# EAGLE design zmJackBoard (EAGLE 8.6.3)
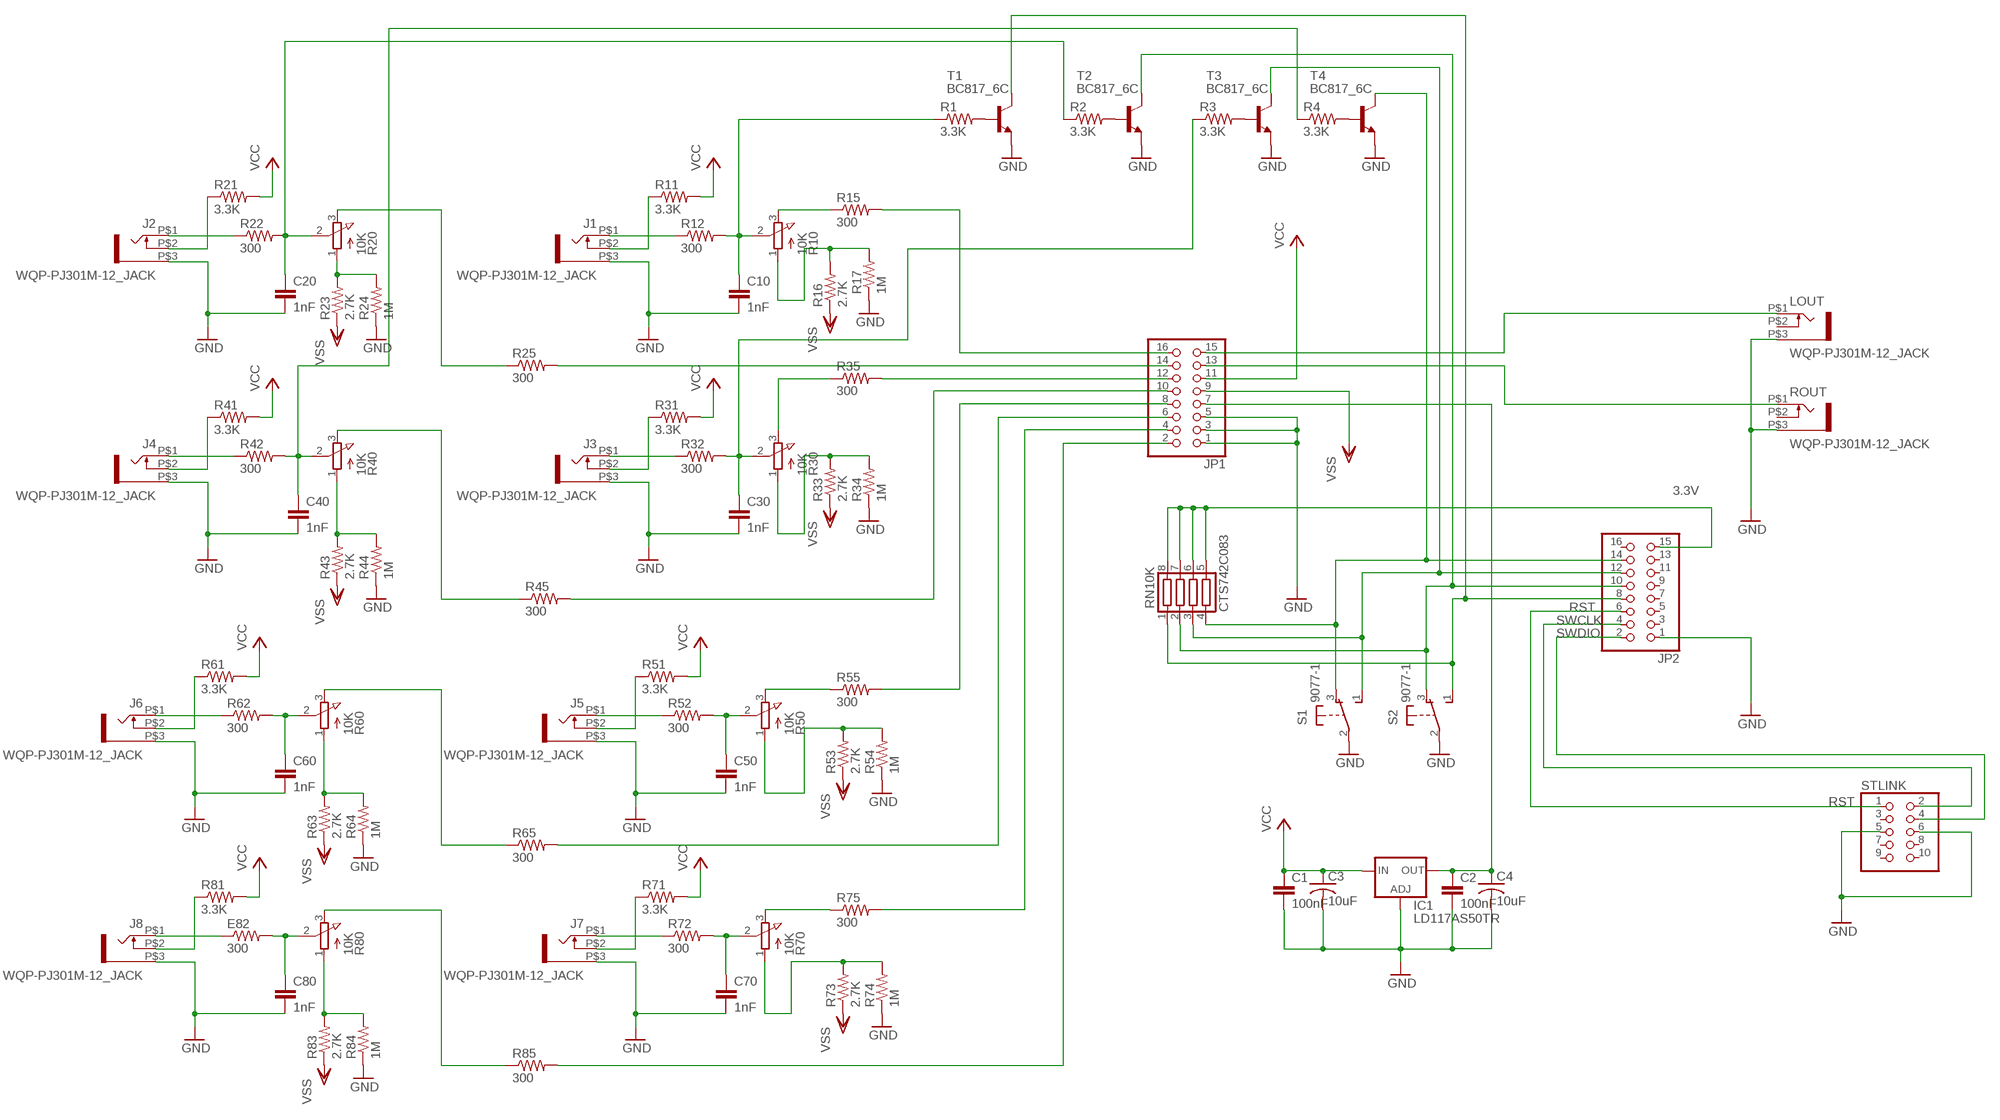
[diagram p0: schematic, sheet 1]

## Parts
C1  100nF  C-EUC0805  [C0805]
C2  100nF  C-EUC0805  [C0805]
C3  10uF  C-USC1206  [C1206]
C4  10uF  C-USC1206  [C1206]
C10  1nF  C-EUC0805  [C0805]
C20  1nF  C-EUC0805  [C0805]
C30  1nF  C-EUC0805  [C0805]
C40  1nF  C-EUC0805  [C0805]
C50  1nF  C-EUC0805  [C0805]
C60  1nF  C-EUC0805  [C0805]
C70  1nF  C-EUC0805  [C0805]
C80  1nF  C-EUC0805  [C0805]
E82  300  R-US_M0805  [M0805]
IC1  LD117AS50TR  [SOT223]
J1  WQP-PJ301M-12_JACK  [WQP-PJ301M-12_JACK]
J2  WQP-PJ301M-12_JACK  [WQP-PJ301M-12_JACK]
J3  WQP-PJ301M-12_JACK  [WQP-PJ301M-12_JACK]
J4  WQP-PJ301M-12_JACK  [WQP-PJ301M-12_JACK]
J5  WQP-PJ301M-12_JACK  [WQP-PJ301M-12_JACK]
J6  WQP-PJ301M-12_JACK  [WQP-PJ301M-12_JACK]
J7  WQP-PJ301M-12_JACK  [WQP-PJ301M-12_JACK]
J8  WQP-PJ301M-12_JACK  [WQP-PJ301M-12_JACK]
JP1  PINHD-2X8  [2X08]
JP2  PINHD-2X8  [2X08]
LOUT  WQP-PJ301M-12_JACK  [WQP-PJ301M-12_JACK]
R1  3.3K  R-US_M0805  [M0805]
R2  3.3K  R-US_M0805  [M0805]
R3  3.3K  R-US_M0805  [M0805]
R4  3.3K  R-US_M0805  [M0805]
R10  10K  EVUF3L  [EVUFXL]
R11  3.3K  R-US_M0805  [M0805]
R12  300  R-US_M0805  [M0805]
R15  300  R-US_M0805  [M0805]
R16  2.7K  R-US_M0805  [M0805]
R17  1M  R-US_M0805  [M0805]
R20  10K  EVUF3L  [EVUFXL]
R21  3.3K  R-US_M0805  [M0805]
R22  300  R-US_M0805  [M0805]
R23  2.7K  R-US_M0805  [M0805]
R24  1M  R-US_M0805  [M0805]
R25  300  R-US_M0805  [M0805]
R30  10K  EVUF3L  [EVUFXL]
R31  3.3K  R-US_M0805  [M0805]
R32  300  R-US_M0805  [M0805]
R33  2.7K  R-US_M0805  [M0805]
R34  1M  R-US_M0805  [M0805]
R35  300  R-US_M0805  [M0805]
R40  10K  EVUF3L  [EVUFXL]
R41  3.3K  R-US_M0805  [M0805]
R42  300  R-US_M0805  [M0805]
R43  2.7K  R-US_M0805  [M0805]
R44  1M  R-US_M0805  [M0805]
R45  300  R-US_M0805  [M0805]
R50  10K  EVUF3L  [EVUFXL]
R51  3.3K  R-US_M0805  [M0805]
R52  300  R-US_M0805  [M0805]
R53  2.7K  R-US_M0805  [M0805]
R54  1M  R-US_M0805  [M0805]
R55  300  R-US_M0805  [M0805]
R60  10K  EVUF3L  [EVUFXL]
R61  3.3K  R-US_M0805  [M0805]
R62  300  R-US_M0805  [M0805]
R63  2.7K  R-US_M0805  [M0805]
R64  1M  R-US_M0805  [M0805]
R65  300  R-US_M0805  [M0805]
R70  10K  EVUF3L  [EVUFXL]
R71  3.3K  R-US_M0805  [M0805]
R72  300  R-US_M0805  [M0805]
R73  2.7K  R-US_M0805  [M0805]
R74  1M  R-US_M0805  [M0805]
R75  300  R-US_M0805  [M0805]
R80  10K  EVUF3L  [EVUFXL]
R81  3.3K  R-US_M0805  [M0805]
R83  2.7K  R-US_M0805  [M0805]
R84  1M  R-US_M0805  [M0805]
R85  300  R-US_M0805  [M0805]
RN10K  CTS742C083  [CTS742C083]
ROUT  WQP-PJ301M-12_JACK  [WQP-PJ301M-12_JACK]
S1  9077-1  [9077-1]
S2  9077-1  [9077-1]
STLINK  PINHD-2X5  [2X05]
T1  BC817_6C  -NPN-SOT23-EBC  [SOT23-EBC]
T2  BC817_6C  -NPN-SOT23-EBC  [SOT23-EBC]
T3  BC817_6C  -NPN-SOT23-EBC  [SOT23-EBC]
T4  BC817_6C  -NPN-SOT23-EBC  [SOT23-EBC]

## Nets
3.3V: JP2.15 RN10K.5 RN10K.6 RN10K.7 RN10K.8
5V: C2.1 C4.1 IC1.4(OUT) JP1.7
ADC1: JP1.16 R15.2
ADC2: JP1.14 R25.2
ADC3: JP1.12 R35.2
ADC4: JP1.10 R45.2
ADC5: JP1.8 R55.2
ADC6: JP1.6 R65.2
ADC7: JP1.4 R75.2
ADC8: JP1.2 R85.2
GND: C1.2 C2.2 C3.2 C4.2 C10.2 C20.2 C30.2 C40.2 C50.2 C60.2 C70.2 C80.2 IC1.1(ADJ) J1.P$3 J2.P$3 J3.P$3 J4.P$3 J5.P$3 J6.P$3 J7.P$3 J8.P$3 JP1.1 JP1.3 JP1.5 JP2.1 LOUT.P$3 R17.1 R24.1 R34.1 R44.1 R54.1 R64.1 R74.1 R84.1 ROUT.P$3 S1.2(P) S2.2(P) STLINK.5 STLINK.6 T1.E T2.E T3.E T4.E
LOUT: JP1.15 LOUT.P$1
N$1: J2.P$1 R22.1
N$2: R30.3(E) R35.1
N$3: J2.P$2 R21.1
N$4: C20.1 R2.1 R20.2(S) R22.2
N$5: J1.P$2 R11.1
N$6: J4.P$2 R41.1
N$7: J4.P$1 R42.1
N$8: C40.1 R4.1 R40.2(S) R42.2
N$12: J1.P$1 R12.1
N$13: J6.P$2 R61.1
N$14: J6.P$1 R62.1
N$15: C60.1 R60.2(S) R62.2
N$16: C10.1 R1.1 R10.2(S) R12.2
N$17: J8.P$2 R81.1
N$18: E82.1 J8.P$1
N$19: C80.1 E82.2 R80.2(S)
N$20: J3.P$2 R31.1
N$21: J3.P$1 R32.1
N$22: C30.1 R3.1 R30.2(S) R32.2
N$23: J5.P$2 R51.1
N$24: J5.P$1 R52.1
N$25: C50.1 R50.2(S) R52.2
N$26: J7.P$2 R71.1
N$27: J7.P$1 R72.1
N$28: C70.1 R70.2(S) R72.2
N$35: JP2.8 RN10K.1 S2.1(S) T1.C
N$36: JP2.10 RN10K.2 S2.3(O) T2.C
N$37: JP2.12 RN10K.3 S1.1(S) T3.C
N$39: JP2.14 RN10K.4 S1.3(O) T4.C
N$40: R1.2 T1.B
N$41: R2.2 T2.B
N$42: R3.2 T3.B
N$43: R4.2 T4.B
N$44: R40.3(E) R45.1
N$46: R20.3(E) R25.1
N$47: R60.3(E) R65.1
N$48: R80.3(E) R85.1
N$49: R10.3(E) R15.1
N$50: R50.3(E) R55.1
N$51: R70.3(E) R75.1
N$53: R10.1(A) R16.2 R17.2
N$57: R80.1(A) R83.2 R84.2
N$58: R60.1(A) R63.2 R64.2
N$59: R40.1(A) R43.2 R44.2
N$60: R20.1(A) R23.2 R24.2
N$61: R30.1(A) R33.2 R34.2
N$62: R50.1(A) R53.2 R54.2
N$63: R70.1(A) R73.2 R74.2
ROUT: JP1.13 ROUT.P$1
RST: JP2.6 STLINK.1
SWCLK: JP2.4 STLINK.2
SWDIO: JP2.2 STLINK.4
VCC: C1.1 C3.1 IC1.3(IN) JP1.11 R11.2 R21.2 R31.2 R41.2 R51.2 R61.2 R71.2 R81.2
VSS: JP1.9 R16.1 R23.1 R33.1 R43.1 R53.1 R63.1 R73.1 R83.1
Unconnected: JP2.3 JP2.5 JP2.7 JP2.9 JP2.11 JP2.13 JP2.16 LOUT.P$2 ROUT.P$2 STLINK.3 STLINK.7 STLINK.8 STLINK.9 STLINK.10

## Library data of the parts
C1 C2 C10 C20 C30 C40 C50 C60 C70 C80 = rcl:C-EU: CAPACITOR, European symbol; SPICEPREFIX: C
C3 C4 = resistor:C-US: CAPACITOR, American symbol
E82 R1-R4 R11 R12 R15-R17 R21-R25 R31-R35 R41-R45 R51-R55 R61-R65 R71-R75 R81 R83-R85 = adafruit:R-US_: RESISTOR, American symbol
IC1 = v-reg:LD117A?*: Low drop fixed and adjustable positive voltage regulators 1 A Source: http://www.st.com/stonline/products/literature/ds/7194/ld1117axx.pdf
J1-J8 LOUT ROUT = thonkiconn 2:WQP-PJ301M-12_JACK
JP1 JP2 = pinhead:PINHD-2X8: PIN HEADER
R10 R20 R30 R40 R50 R60 R70 R80 = pot:EVU: 9 mm Square Rotary Potentiometers Source: Panasonic
RN10K = resistor-net:CTS742C083: Chip Resistor Array 4 Single Resistor Source: http://www.ctscorp.com/components/Datasheets/CTSChipArrayDs.pdf; OC_FARNELL: unknown; OC_NEWARK: unknown
S1 S2 = switch-misc:9077-1: MARQUARDT SWITCH 9077.0100 Distributor: Buerklin <https://www.buerklin.com/default.asp?event=ShowArtikel%2812G2820%29&l=d&jump=ArtNr_12G2820>
STLINK = pinhead:PINHD-2X5: PIN HEADER
T1-T4 = transistor-neu-to92:*-NPN-: NPN Transistror

## Net classes
0 default: width 0.127 mm
1 GND: width 0.508 mm, drill 0.203 mm, clearance 0.203 mm

## Board
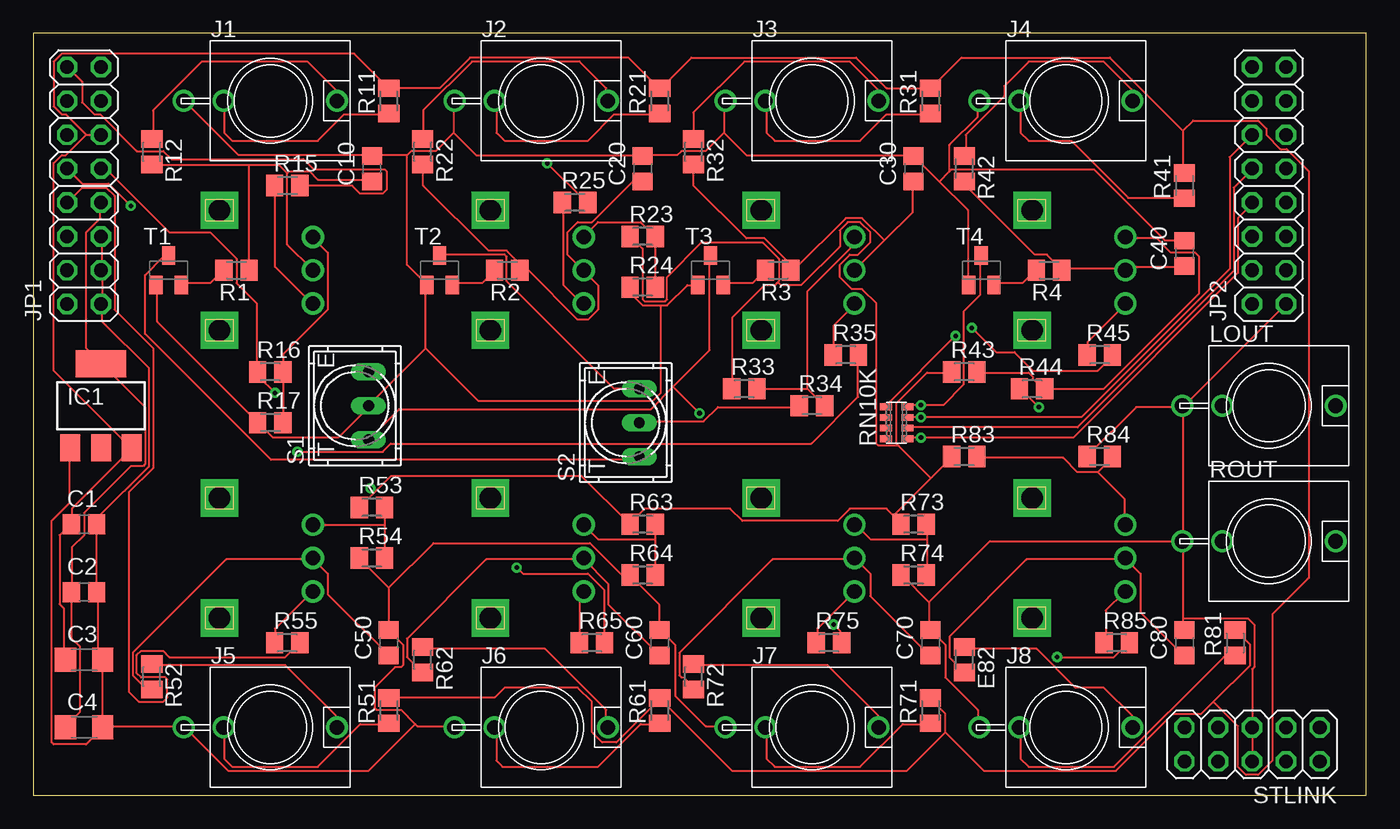
[diagram p1: board, top side]
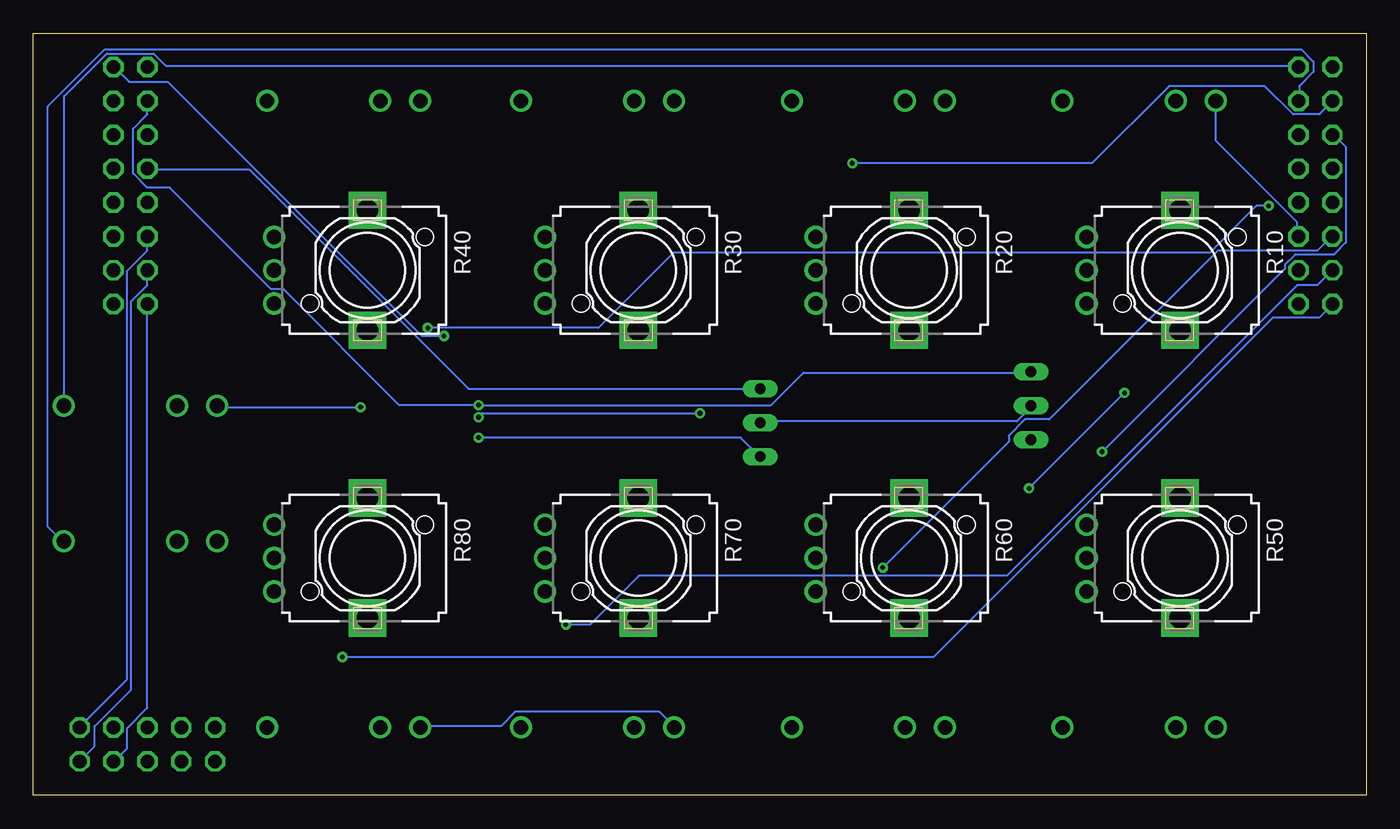
[diagram p2: board, bottom side, seen from below]

Size 100 x 57.14 mm. Coordinates in mm from the lower left corner, seen from the top.
Outline: 0,0 100,0 100,57.14 0,57.14 0,0
Copper layers (1*16): Top 0.035mm / dielectric 1.5mm / Bottom 0.035mm
Design rules "default": minimum track width 6mil, minimum drill 0.35mm, track to track 6mil, track to pad 6mil, pad to pad 6mil, via to via 6mil, smd to smd 6mil, copper to edge 40mil, drill to drill 6mil, minimum pad ring 10mil, minimum via ring 8mil, stop-mask expansion 4mil, vias tented up to drill 0mil, thermal gap 10mil

### Footprints (pad centres in the part's own frame; a part is rotated, then mirrored left to right if it is on the bottom)
C0805 = smd 1.3 x 1.5: 1 -0.95,0; 2 0.95,0
C1206 = smd 1.6 x 1.8: 1 -1.4,0; 2 1.4,0
M0805 = smd 1.3 x 1.6: 1 -0.95,0; 2 0.95,0
SOT223 = smd 1.5 x 2: 1 -2.3,-3.15; 2 0,-3.15; 3 2.3,-3.15 | smd 3.8 x 2: 4 0,3.15
WQP-PJ301M-12_JACK = drill 1.1: P$1 0,5; P$2 0,-3.5; P$3 0,-6.5
2X08 = drill 1.016 octagon: 1 -8.89,-1.27; 2 -8.89,1.27; 3 -6.35,-1.27; 4 -6.35,1.27; 5 -3.81,-1.27; 6 -3.81,1.27; 7 -1.27,-1.27; 8 -1.27,1.27; 9 1.27,-1.27; 10 1.27,1.27; 11 3.81,-1.27; 12 3.81,1.27; 13 6.35,-1.27; 14 6.35,1.27; 15 8.89,-1.27; 16 8.89,1.27
EVUFXL = drill 1.1 pad 1.676: 1 -2.5,-7; 2 0,-7; 3 2.5,-7 | drill 1.6 pad 2.8 square: M1 4.5,0; M2 -4.5,0
CTS742C083 = smd 0.5 x 0.9: 1 -1.2,-0.8; 2 -0.4,-0.8; 3 0.4,-0.8; 4 1.2,-0.8; 5 1.2,0.8; 6 0.4,0.8; 7 -0.4,0.8; 8 -1.2,0.8
9077-1 = drill 0.813 long: 1 -2.54,-1.016; 2 0,-1.016; 3 2.54,-1.016
2X05 = drill 1.016 octagon: 1 -5.08,-1.27; 2 -5.08,1.27; 3 -2.54,-1.27; 4 -2.54,1.27; 5 0,-1.27; 6 0,1.27; 7 2.54,-1.27; 8 2.54,1.27; 9 5.08,-1.27; 10 5.08,1.27
SOT23-EBC = smd 1 x 1.4: B 0.95,-1.1; C 0,1.1; E -0.95,-1.1

### Placement (x,y rotation side)
C1  3.81,20.32 0 top
C2  3.81,15.24 0 top
C3  3.81,10.16 0 top
C4  3.81,5.08 0 top
C10  25.4,46.99 90 top
C20  45.72,46.99 90 top
C30  66.04,46.99 90 top
C40  86.36,40.64 90 top
C50  26.67,11.43 90 top
C60  46.99,11.43 90 top
C70  67.31,11.43 90 top
C80  86.36,11.43 90 top
E82  69.85,10.16 270 top
IC1  5.08,29.21 0 top
J1  17.78,52.07 270 top
J2  38.1,52.07 270 top
J3  58.42,52.07 270 top
J4  77.47,52.07 270 top
J5  17.78,5.08 270 top
J6  38.1,5.08 270 top
J7  58.42,5.08 270 top
J8  77.47,5.08 270 top
JP1  3.81,45.72 90 top
JP2  92.71,45.72 90 top
LOUT  92.71,29.21 270 top
R1  15.24,39.37 180 top
R2  35.56,39.37 180 top
R3  55.88,39.37 180 top
R4  76.2,39.37 180 top
R10  13.97,39.37 270 bottom
R11  26.67,52.07 90 top
R12  8.89,48.26 270 top
R15  19.05,45.72 0 top
R16  17.78,31.75 0 top
R17  17.78,27.94 0 top
R20  34.29,39.37 270 bottom
R21  46.99,52.07 90 top
R22  29.21,48.26 270 top
R23  45.72,41.91 0 top
R24  45.72,38.1 0 top
R25  40.64,44.45 0 top
R30  54.61,39.37 270 bottom
R31  67.31,52.07 90 top
R32  49.53,48.26 270 top
R33  53.34,30.48 0 top
R34  58.42,29.21 0 top
R35  60.96,33.02 0 top
R40  74.93,39.37 270 bottom
R41  86.36,45.72 90 top
R42  69.85,46.99 270 top
R43  69.85,31.75 0 top
R44  74.93,30.48 0 top
R45  80.01,33.02 0 top
R50  13.97,17.78 270 bottom
R51  26.67,6.35 90 top
R52  8.89,8.89 270 top
R53  25.4,21.59 0 top
R54  25.4,17.78 0 top
R55  19.05,11.43 0 top
R60  34.29,17.78 270 bottom
R61  46.99,6.35 90 top
R62  29.21,10.16 270 top
R63  45.72,20.32 0 top
R64  45.72,16.51 0 top
R65  41.91,11.43 0 top
R70  54.61,17.78 270 bottom
R71  67.31,6.35 90 top
R72  49.53,8.89 270 top
R73  66.04,20.32 0 top
R74  66.04,16.51 0 top
R75  59.69,11.43 0 top
R80  74.93,17.78 270 bottom
R81  90.17,11.43 90 top
R83  69.85,25.4 0 top
R84  80.01,25.4 0 top
R85  81.28,11.43 0 top
RN10K  64.77,27.94 90 top
ROUT  92.71,19.05 270 top
S1  24.13,29.21 90 top
S2  44.45,27.94 90 top
STLINK  91.44,3.81 180 top
T1  10.16,39.37 0 top
T2  30.48,39.37 0 top
T3  50.8,39.37 0 top
T4  71.12,39.37 0 top

### Tracks (layer width: path | path; a pad name or v marks a point on that pad's centre or on a via)
3.3V  (via drill 0.35)
  Top 0.152: RN10K.8 64.01,26.82 64.01,27.43 RN10K.7 64.01,27.58 64.01,28.19 RN10K.6 64.01,28.35 64.01,29.11 RN10K.5 64.01,29.26 v69.19,34.44
  Bottom 0.152: v69.19,34.44 70.87,34.44 89.92,53.49 92.81,53.49 93.88,54.56 JP2.15
5V
  Top 0.152: 2.9,15.24 2.9,11.73 3.5,11.12 3.5,6.25 2.44,5.18 C4.1 | JP1.7 5.03,44.35 5.03,43.28 3.96,42.22 3.96,33.53 5.03,32.46 IC1.4 5.18,32.31 8.38,29.11 8.38,24.84 8.23,24.69 7.32,24.69 3.81,21.18 3.81,19.51 2.9,18.59 2.9,15.24 | 2.9,15.24 C2.1
ADC1
  Top 0.152: R15.2 23.93,45.72 24.54,45.11 26.21,45.11 26.52,45.41 26.52,46.79 26.36,46.94 21.03,46.94 20.27,47.7 10.36,47.7 9.75,48.31 7.77,48.31 5.03,51.05 4.57,51.05 3.66,51.97 3.66,53.49 JP1.16
ADC2  (via drill 0.35)
  Top 0.152: v38.56,47.4 41.45,44.5 R25.2
  Bottom 0.152: v38.56,47.4 20.57,47.4 14.78,53.19 7.62,53.19 5.49,51.05 3.5,51.05 2.59,51.97 JP1.14
ADC3  (via drill 0.35)
  Top 0.152: v19.81,25.76 26.21,25.76 26.82,26.36 58.37,26.36 61.87,29.87 61.87,32.92 R35.2
  Bottom 0.152: v19.81,25.76 6.1,39.47 6.1,39.78 5.33,40.54 2.44,40.54 1.52,41.45 1.52,48.62 2.44,49.53 JP1.12
ADC4  (via drill 0.35)
  Top 0.152: v70.41,35.05 72.24,33.22 73.61,33.22 74.98,31.85 79.86,31.85 80.92,32.92 R45.2 | v7.32,44.2 5.64,45.87 3.66,45.87 JP1.10
  Bottom 0.152: v70.41,35.05 57.61,35.05 51.97,40.69 11.73,40.69 8.23,44.2 v7.32,44.2
ADC5
  Top 0.152: JP1.8 3.66,45.57 5.49,45.57 6.1,44.96 6.1,36.42 8.99,33.53 8.99,24.54 7.16,22.71 7.16,7.77 7.92,7.01 9.75,7.01 10.06,7.32 10.06,8.69 9.91,8.84 8.08,8.84 7.77,9.14 7.77,10.52 8.08,10.82 9.75,10.82 10.21,10.36 18.9,10.36 19.96,11.43 R55.2
ADC6  (via drill 0.35)
  Top 0.152: v36.27,17.07 36.73,16.61 41.6,16.61 42.82,15.39 42.82,11.43 R65.2
  Bottom 0.152: v36.27,17.07 26.82,26.52 26.82,26.98 25.6,28.19 23.77,28.19 11.12,40.84 3.66,40.84 2.59,41.91 JP1.6
ADC7  (via drill 0.35)
  Top 0.152: v60.05,12.8 60.5,12.34 60.5,11.43 R75.2
  Bottom 0.152: v60.05,12.8 58.22,12.8 54.56,16.46 26.98,16.46 5.18,38.25 3.66,38.25 JP1.4
ADC8  (via drill 0.35)
  Top 0.152: v76.81,10.36 81.08,10.36 82.14,11.43 R85.2
  Bottom 0.152: v76.81,10.36 32.46,10.36 7.01,35.81 3.5,35.81 2.59,36.73 JP1.2
GND  (via drill 0.35)
  Top 0.152: 67.97,46.02 66.14,47.85 C30.2 65.99,48.01 53.49,48.01 51.82,49.68 | 67.97,46.02 70.1,43.89 70.1,38.41 T4.E | 67.97,46.02 68.73,46.79 | 68.73,46.79 68.89,46.94 79.55,46.94 84.89,41.6 86.26,41.6 C40.2 | 68.73,46.79 68.73,48.77 70.87,50.9 70.87,51.97 J4.P$3 | JP1.5 5.18,41.91 5.18,39.47 JP1.3 5.18,39.32 5.18,36.88 JP1.1 5.18,36.73 5.18,35.51 8.69,32 8.69,24.69 4.88,20.88 4.88,20.42 C1.2 4.72,20.27 4.72,15.24 C2.2 4.88,15.24 4.88,10.52 5.18,10.21 C3.2 5.18,10.06 5.18,5.18 C4.2 | T1.E 9.3,38.25 9.3,35.51 16.76,28.04 R17.1 16.92,27.89 17.98,26.82 22.86,26.82 25.15,29.11 S1.2 25.15,29.26 29.41,33.53 | R34.1 57.45,29.11 51.36,29.11 50.29,28.04 45.57,28.04 S2.2 | 45.72,48.01 48.31,48.01 48.62,48.31 50.44,48.31 51.82,49.68 | 51.82,49.68 51.82,51.97 J3.P$3 | 28.04,48.01 25.45,48.01 C10.2 25.3,48.01 15.39,48.01 11.43,51.97 J1.P$3 | 28.04,48.01 28.35,48.31 30.18,48.31 31.55,49.68 | 31.55,49.68 31.55,51.97 J2.P$3 | 47.09,36.73 45.72,36.73 44.81,37.64 44.81,38.1 R24.1 | 47.09,36.73 47.55,36.73 49.07,38.25 49.84,38.25 T3.E | 29.41,33.53 29.41,38.25 T2.E 29.41,38.41 28.04,39.78 28.04,48.01 | 47.09,36.73 47.09,30.18 46.48,29.57 33.38,29.57 29.41,33.53 | 45.72,48.01 33.22,48.01 31.55,49.68 | 45.72,48.01 C20.2 | STLINK.6 STLINK.5 91.44,9.45 91.59,9.6 91.59,12.8 91.14,13.26 86.26,13.26 | 86.26,19.05 86.26,13.26 | 86.26,13.26 86.26,12.5 C80.2 | R84.1 79.1,25.45 82.75,29.11 86.11,29.11 LOUT.P$3 86.26,29.11 | v75.44,29.11 74.07,30.48 R44.1 | 86.26,29.11 JP2.1 | 86.26,29.11 86.26,19.05 | 86.26,19.05 ROUT.P$3 71.78,19.05 67.21,14.48 | 67.21,14.48 67.21,12.5 C70.2 67.36,12.34 68.43,11.28 68.43,8.84 70.87,6.4 70.87,5.18 J8.P$3
  Top 0.152: 67.21,14.48 65.23,16.46 R74.1 | J7.P$3 51.82,5.18 50.44,5.18 48.16,7.47 48.16,11.28 47.09,12.34 C60.2 46.94,12.5 46.94,14.33 44.81,16.46 R64.1 44.65,16.61 44.04,16.61 41.76,18.9 30.02,18.9 26.67,15.54 | 26.67,15.54 C50.2 26.67,12.34 27.74,11.28 27.74,9.75 27.58,9.6 27.13,9.6 25.6,8.08 25.6,6.55 25.76,6.4 27.58,6.4 28.65,5.33 | 26.67,15.54 24.54,17.68 R54.1 | 28.65,5.33 28.8,5.18 31.55,5.18 J6.P$3 | IC1.1 2.74,25.91 2.74,21.95 1.37,20.57 1.37,3.96 1.52,3.81 3.96,3.81 5.18,5.03 C4.2 | C4.2 5.33,5.18 11.28,5.18 J5.P$3 11.43,5.03 14.63,1.83 25.15,1.83 28.65,5.33
  Bottom 0.152: J1.P$3 11.28,51.97 11.28,49.07 5.18,42.98 5.18,41.91 JP1.5 | S2.2 45.41,28.04 26.21,28.04 25.15,29.11 S1.2 | v75.44,29.11 86.11,29.11 LOUT.P$3 | J8.P$3 70.87,5.18 64.92,5.18 63.86,6.25 53.03,6.25 51.97,5.18 J7.P$3
LOUT
  Bottom 0.152: JP1.15 5.18,54.71 90.07,54.71 90.98,55.63 94.49,55.63 97.69,52.43 97.69,29.26 LOUT.P$1
N$1
  Top 0.152: R22.1 29.26,49.23 29.26,51.36 32.92,55.02 41,55.02 42.98,53.03 42.98,52.12 J2.P$1
N$2
  Top 0.152: R35.1 60.05,33.07 60.05,35.2 61.57,36.73 R30.3
N$3
  Top 0.152: R21.1 46.94,51.05 43.59,51.05 41.6,49.07 35.36,49.07 34.75,49.68 34.75,51.97 J2.P$2
N$4
  Top 0.152: C20.1 45.72,46.02 44.96,46.02 41.91,42.98 40.84,42.98 40.08,42.22 40.08,40.54 41.15,39.47 R20.2 41.3,39.32 42.37,38.25 42.37,36.42 41.6,35.66 40.84,35.66 37.19,39.32 36.58,39.32 R2.1 36.42,39.47 36.42,39.93 35.51,40.84 34.14,40.84 29.26,45.72 29.26,47.24 R22.2
N$5
  Top 0.152: R11.1 26.67,51.05 23.32,51.05 21.34,49.07 14.94,49.07 14.33,49.68 14.33,51.97 J1.P$2
N$6
  Top 0.152: R41.1 86.26,44.81 82.14,44.81 77.88,49.07 74.68,49.07 74.07,49.68 74.07,51.97 J4.P$2
N$7
  Top 0.152: R42.1 69.95,48.01 69.95,49.53 72.85,52.43 72.85,53.19 74.68,55.02 80.31,55.02 82.45,52.88 82.45,52.12 J4.P$1
N$8
  Top 0.152: C40.1 86.26,39.62 82.14,39.62 81.99,39.47 R40.2 81.84,39.47 77.27,39.47 R4.1 77.11,39.47 76.05,40.54 75.13,40.54 69.95,45.72 69.95,46.02 R42.2
N$12
  Top 0.152: R12.1 8.99,49.23 8.99,51.36 12.65,55.02 20.57,55.02 22.71,52.88 22.71,52.12 J1.P$1
N$13
  Top 0.152: R61.1 46.94,5.33 45.57,5.33 42.37,2.13 35.2,2.13 34.75,2.59 34.75,5.03 J6.P$2
N$14
  Top 0.152: R62.1 29.26,10.97 38.41,10.97 42.98,6.4 42.98,5.18 J6.P$1
N$15
  Top 0.152: C60.1 46.94,10.52 43.13,14.33 43.13,15.85 41.3,17.68 R60.2 41.15,17.68 33.98,17.68 28.04,11.73 28.04,10.36 29.11,9.3 R62.2
N$16
  Top 0.152: 19.05,46.63 19.2,46.79 20.73,46.79 21.34,46.18 25.3,46.18 C10.1 | 19.05,46.63 19.05,41.3 20.88,39.47 R10.2 | 16.15,47.24 18.44,47.24 19.05,46.63 | 16.15,47.24 8.99,47.24 R12.2 | 16.15,47.24 16.15,39.47 R1.1
N$17
  Top 0.152: R81.1 90.07,10.36 89.31,10.36 81.08,2.13 74.68,2.13 74.07,2.74 74.07,5.03 J8.P$2
N$18
  Top 0.152: E82.1 69.95,10.97 75.29,10.97 78.18,8.08 80.31,8.08 82.45,5.94 82.45,5.18 J8.P$1
N$19
  Top 0.152: C80.1 86.26,10.52 83.06,13.72 83.06,16.61 81.99,17.68 R80.2 81.84,17.68 74.52,17.68 68.73,11.89 68.73,10.36 69.8,9.3 E82.2
N$20
  Top 0.152: R31.1 67.21,51.05 64.01,51.05 62.03,49.07 55.63,49.07 55.02,49.68 55.02,51.97 J3.P$2
N$21
  Top 0.152: R32.1 49.53,51.21 53.34,55.02 61.27,55.02 63.4,52.88 63.4,52.12 J3.P$1
N$22
  Top 0.152: 63.86,41.6 61.72,39.47 R30.2 | 63.86,41.6 65.99,43.74 65.99,46.02 C30.1 | 63.86,41.6 62.18,43.28 60.96,43.28 57.15,39.47 56.84,39.47 R3.1 56.69,39.47 56.69,39.93 54.86,41.76 53.49,41.76 49.53,45.72 R32.2
N$23
  Top 0.152: R51.1 26.67,5.33 24.54,5.33 21.34,2.13 14.94,2.13 14.33,2.74 14.33,5.03 J5.P$2
N$24
  Top 0.152: R52.1 8.99,9.75 18.9,9.75 22.71,5.94 22.71,5.18 J5.P$1
N$25
  Top 0.152: C50.1 26.67,10.52 22.1,15.09 22.1,16.61 21.03,17.68 R50.2 20.88,17.68 14.48,17.68 7.47,10.67 7.47,8.99 8.38,8.08 8.84,8.08 R52.2
N$26
  Top 0.152: R71.1 67.21,5.33 65.23,5.33 62.03,2.13 55.63,2.13 55.02,2.74 55.02,5.03 J7.P$2
N$27
  Top 0.152: R72.1 49.53,9.75 59.59,9.75 63.4,5.94 63.4,5.18 J7.P$1
N$28
  Top 0.152: C70.1 67.21,10.52 62.79,14.94 62.79,16.61 61.72,17.68 R70.2 61.57,17.68 55.47,17.68 48.46,10.67 48.46,8.99 48.62,8.84 48.77,8.84 49.53,8.08 R72.2
N$35  (via drill 0.35)
  Top 0.152: RN10K.1 65.68,26.82 v66.6,26.82 78.03,26.82 90.37,39.17 90.37,43.28 91.44,44.35 JP2.8 | T1.C 10.06,40.39 9.75,40.39 8.38,39.01 8.38,34.59 17.83,25.15 45.26,25.15 45.41,25.3 S2.1
  Bottom 0.152: v66.6,26.82 46.94,26.82 45.57,25.45 S2.1
N$36
  Top 0.152: S2.3 43.59,30.48 35.51,38.56 35.51,40.39 35.36,40.54 30.48,40.54 T2.C | RN10K.2 65.68,27.58 78.33,27.58 90.07,39.32 90.07,45.57 91.44,46.94 JP2.10
  Bottom 0.152: S2.3 67.36,30.48 83.82,46.94 91.44,46.94 JP2.10
N$37  (via drill 0.35)
  Top 0.152: 48.01,30.63 46.33,28.96 27.43,28.96 S1.1 | 48.01,30.63 50.75,33.38 50.75,40.39 T3.C | JP2.12 89.76,47.85 89.76,39.47 78.64,28.35 v66.6,28.35 65.68,28.35 RN10K.3 | v49.99,28.65 48.01,30.63
  Bottom 0.152: v49.99,28.65 66.29,28.65 v66.6,28.35
N$39  (via drill 0.35)
  Top 0.152: RN10K.4 65.68,29.26 v66.6,29.26 68.28,29.26 69.8,30.79 69.8,36.27 71.02,37.49 71.02,40.39 T4.C
  Bottom 0.152: S1.3 25.15,31.7 42.22,31.7 44.65,29.26 v66.6,29.26 72.54,29.26 81.23,37.95 82.14,37.95 89.76,45.57 91.44,45.57 92.51,46.63 92.51,49.99 91.44,51.05 JP2.14
N$40
  Top 0.152: T1.B 11.12,38.41 13.26,38.41 14.17,39.32 R1.2
N$41
  Top 0.152: T2.B 31.55,38.41 33.68,38.41 34.59,39.32 R2.2
N$42
  Top 0.152: T3.B 51.82,38.41 53.95,38.41 54.86,39.32 R3.2
N$43
  Top 0.152: T4.B 72.08,38.41 74.22,38.41 75.13,39.32 R4.2
N$44
  Top 0.152: R45.1 79.1,33.07 79.1,33.98 81.84,36.73 R40.3
N$46
  Top 0.152: R25.1 39.78,44.35 39.78,38.25 41.15,36.88 R20.3
N$47
  Top 0.152: R65.1 41,11.43 41,15.09 41.15,15.24 R60.3
N$48
  Top 0.152: R85.1 80.47,11.43 80.47,13.87 81.84,15.24 R80.3
N$49
  Top 0.152: R15.1 18.14,45.72 18.14,39.62 20.88,36.88 R10.3
N$50
  Top 0.152: R55.1 18.14,11.43 18.14,12.5 20.88,15.24 R50.3
N$51
  Top 0.152: R75.1 58.83,11.43 58.83,12.5 61.57,15.24 R70.3
N$53
  Top 0.152: R17.2 18.75,28.04 18.75,31.7 R16.2 18.75,31.85 18.75,33.07 22.1,36.42 22.1,40.69 21.03,41.76 R10.1
N$57
  Top 0.152: 79.86,24.23 78.33,24.23 77.27,25.3 70.87,25.3 R83.2 | 79.86,24.23 80.92,25.3 R84.2 | 79.86,24.23 81.84,22.25 81.84,20.42 R80.1
N$58
  Top 0.152: 46.63,19.2 46.63,20.27 R63.2 | 46.63,19.2 46.63,16.61 R64.2 | 46.63,19.2 42.37,19.2 41.3,20.27 R60.1
N$59
  Top 0.152: R43.2 70.87,31.7 74.68,31.7 74.98,31.39 74.98,31.24 75.74,30.48 R44.2 80.31,30.48 87.48,37.64 87.48,40.39 87.17,40.69 85.34,40.69 84.28,41.76 81.99,41.76 R40.1
N$60
  Top 0.152: 46.63,41.91 46.63,38.1 R24.2 | 46.63,41.91 45.57,42.98 42.37,42.98 41.3,41.91 R20.1 | 46.63,41.91 R23.2
N$61
  Top 0.152: 58.06,30.48 59.28,29.26 R34.2 | R33.2 58.06,30.48 | 58.06,30.48 58.06,37.8 61.57,41.3 61.57,41.76 R30.1
N$62
  Top 0.152: 26.36,20.27 26.36,21.49 R53.2 | 26.36,20.27 26.36,17.83 R54.2 | 26.36,20.27 21.03,20.27 R50.1
N$63
  Top 0.152: 67.06,19.2 67.06,20.27 R73.2 | 67.06,19.2 67.06,16.61 R74.2 | 67.06,19.2 62.79,19.2 61.72,20.27 R70.1
ROUT
  Bottom 0.152: JP1.13 5.03,52.12 5.03,53.19 3.96,54.25 3.96,55.02 4.88,55.93 94.64,55.93 98.91,51.66 98.91,20.12 97.84,19.05 ROUT.P$1
RST
  Bottom 0.152: JP2.6 91.44,40.84 92.96,39.32 92.96,8.69 96.47,5.18 STLINK.1
SWCLK
  Bottom 0.152: JP2.4 91.44,38.25 92.66,37.03 92.66,7.92 95.4,5.18 95.4,3.66 STLINK.2
SWDIO
  Bottom 0.152: JP2.2 91.44,6.55 92.96,5.03 92.96,3.5 93.88,2.59 STLINK.4
VCC
  Top 0.152: R51.2 26.67,7.32 34.59,7.32 35.36,8.08 40.84,8.08 41.91,7.01 41.91,4.72 42.67,3.96 43.74,3.96 46.94,7.16 R61.2 47.09,7.16 52.43,1.83 65.53,1.83 68.43,4.72 | 68.43,4.72 68.43,6.1 67.36,7.16 R71.2 | 88.54,7.01 87.63,6.1 85.5,6.1 81.23,1.83 71.32,1.83 68.43,4.72 | 88.54,7.01 91.29,9.75 91.29,11.28 90.22,12.34 R81.2 | C3.1 2.29,10.21 2.29,14.02 1.98,14.33 1.98,19.51 2.74,20.27 C1.1 2.9,20.42 2.9,21.49 7.32,25.91 IC1.3 7.32,26.06 1.52,31.85 1.52,47.4 2.13,48.01 2.44,48.01 3.96,49.53 | 3.96,49.53 JP1.11 | 26.67,53.03 30.48,53.03 32.77,55.32 44.65,55.32 46.94,53.03 R21.2 47.09,53.03 49.38,55.32 61.72,55.32 64.01,53.03 67.21,53.03 R31.2 67.36,53.03 69.65,55.32 80.77,55.32 86.26,49.84 | 86.26,49.84 86.26,46.79 R41.2 | 3.96,49.53 2.44,51.05 2.13,51.05 1.52,51.66 1.52,55.02 2.13,55.63 24.08,55.63 26.67,53.03 | 26.67,53.03 R11.2 | 88.54,7.01 90.37,5.18 90.37,2.13 90.98,1.52 91.9,1.52 92.96,2.59 92.96,13.56 95.71,16.31 95.71,46.79 94.03,48.46 93.57,48.46 92.51,49.53 92.51,49.99 91.9,50.6 87.02,50.6 86.26,49.84
VSS  (via drill 0.35)
  Top 0.152: JP1.9 5.18,46.94 5.49,46.94 10.21,42.22 13.26,42.22 15.24,40.23 15.24,38.41 16.76,36.88 16.76,31.85 R16.1 16.92,31.7 16.92,31.39 v18.14,30.18 | 55.78,38.41 55.93,38.56 55.93,40.23 54.71,41.45 50.14,41.45 47.55,38.86 47.55,37.19 47.4,37.03 45.87,37.03 45.72,37.19 45.72,41 44.81,41.91 R23.1 | 55.78,38.41 55.63,38.25 54.86,38.25 52.43,35.81 52.43,30.48 R33.1 | 64.47,21.03 65.08,20.42 R73.1 64.47,21.03 | 64.47,21.03 64.01,21.49 61.27,21.49 60.35,20.57 53.19,20.57 52.27,21.49 45.87,21.49 44.81,20.42 R63.1 44.65,20.42 41.15,23.93 26.82,23.93 25.6,22.71 | 25.6,22.71 24.54,21.64 R53.1 | 67.36,23.77 64.62,21.03 64.47,21.03 | 67.36,23.77 68.89,25.3 R83.1 | 67.36,23.77 64.92,26.21 | 64.92,26.21 64.77,26.36 64.77,29.41 67.06,31.7 68.89,31.7 R43.1 | 55.78,38.41 55.93,38.41 56.08,38.25 57.61,38.25 60.5,41.15 60.5,42.37 61.11,42.98 62.03,42.98 62.79,42.22 62.79,41.45 61.87,40.54 61.27,40.54 60.5,39.78 60.5,38.86 61.42,37.95 62.18,37.95 63.25,36.88 63.25,26.36 63.4,26.21 64.92,26.21 | 25.6,22.71 v25.3,23.01
  Bottom 0.152: v25.3,23.01 v18.14,30.18